# EAGLE design mega_connector_shield (EAGLE 7.3.0)
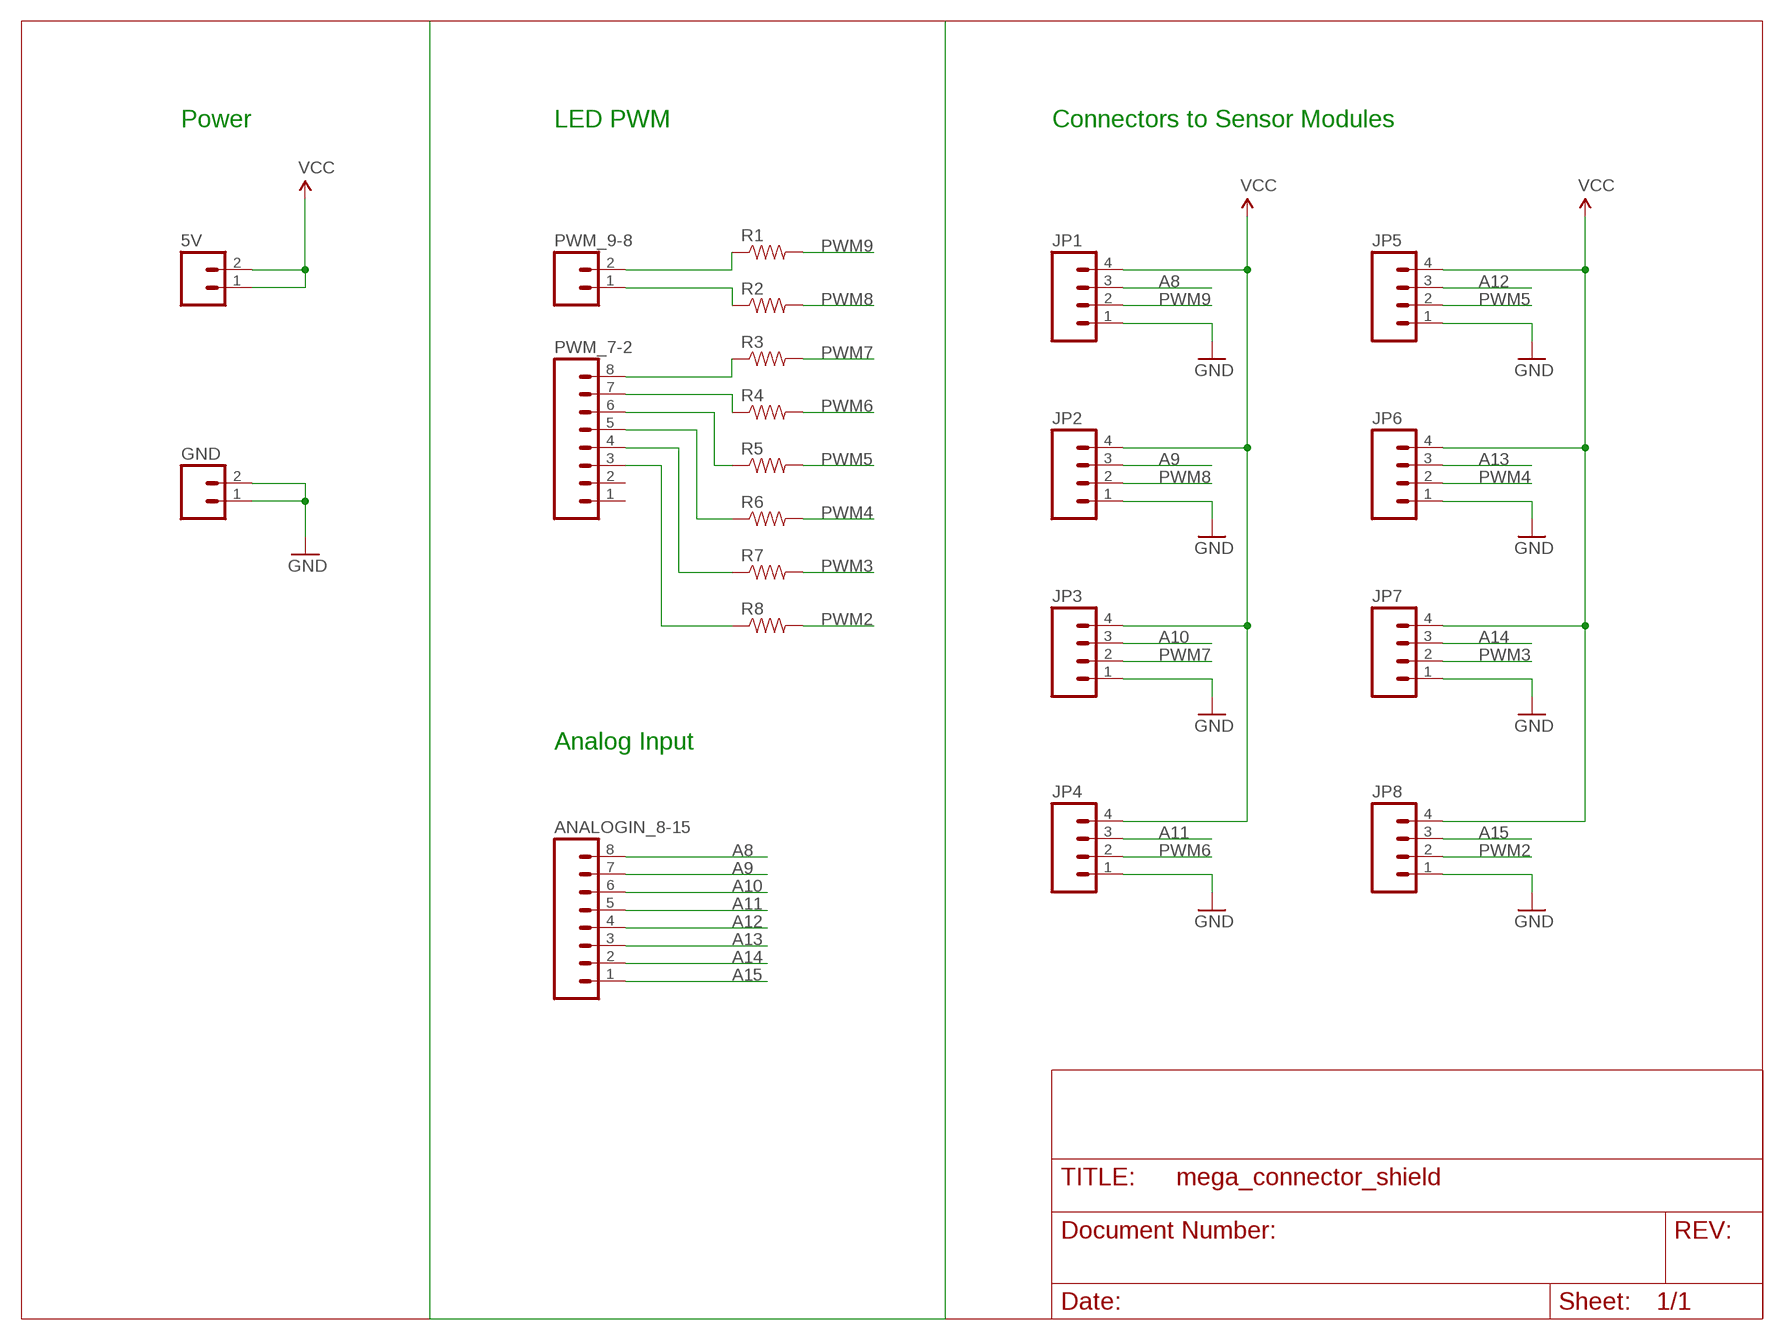
[diagram p0: schematic, sheet 1]

## Parts
5V  M02PTH  [1X02]
ANALOGIN_8-15  M08  [1X08_ROUND]
GND  M02PTH  [1X02]
JP1  M04POLAR  [MOLEX-1X4]
JP2  M04POLAR  [MOLEX-1X4]
JP3  M04POLAR  [MOLEX-1X4]
JP4  M04POLAR  [MOLEX-1X4]
JP5  M04POLAR  [MOLEX-1X4]
JP6  M04POLAR  [MOLEX-1X4]
JP7  M04POLAR  [MOLEX-1X4]
JP8  M04POLAR  [MOLEX-1X4]
PWM_7-2  M08  [1X08_ROUND]
PWM_9-8  M02PTH  [1X02]
R1  RESISTOR1206  [1206]
R2  RESISTOR1206  [1206]
R3  RESISTOR1206  [1206]
R4  RESISTOR1206  [1206]
R5  RESISTOR1206  [1206]
R6  RESISTOR1206  [1206]
R7  RESISTOR1206  [1206]
R8  RESISTOR1206  [1206]

## Nets
A8: ANALOGIN_8-15.8 JP1.3
A9: ANALOGIN_8-15.7 JP2.3
A10: ANALOGIN_8-15.6 JP3.3
A11: ANALOGIN_8-15.5 JP4.3
A12: ANALOGIN_8-15.4 JP5.3
A13: ANALOGIN_8-15.3 JP6.3
A14: ANALOGIN_8-15.2 JP7.3
A15: ANALOGIN_8-15.1 JP8.3
GND: GND.1 GND.2 JP1.1 JP2.1 JP3.1 JP4.1 JP5.1 JP6.1 JP7.1 JP8.1
N$1: PWM_9-8.2 R1.1
N$2: PWM_9-8.1 R2.1
N$3: PWM_7-2.8 R3.1
N$5: PWM_7-2.7 R4.1
N$7: PWM_7-2.6 R5.1
N$9: PWM_7-2.5 R6.1
N$11: PWM_7-2.4 R7.1
N$12: PWM_7-2.3 R8.1
PWM2: JP8.2 R8.2
PWM3: JP7.2 R7.2
PWM4: JP6.2 R6.2
PWM5: JP5.2 R5.2
PWM6: JP4.2 R4.2
PWM7: JP3.2 R3.2
PWM8: JP2.2 R2.2
PWM9: JP1.2 R1.2
VCC: 5V.1 5V.2 JP1.4 JP2.4 JP3.4 JP4.4 JP5.4 JP6.4 JP7.4 JP8.4
Unconnected: PWM_7-2.1 PWM_7-2.2

## Notes on the sheet
- Power | LED PWM | Connectors to Sensor Modules
- Analog Input

## Library data of the parts
5V GND PWM_9-8 = SparkFun-Connectors:M02: Standard 2-pin 0.1" header. Use with - straight break away headers ( PRT-00116) - right angle break away headers (PRT-00553) - swiss pins (PRT-00743) - machine pins (PRT-00117) - female headers (PRT-00115) Molex polarized connector foot print use with: PRT-08233 with associated crimp pins and housings. 2.54_SCREWTERM for use with PRT-10571. 3.5mm Screw Terminal footprints for PRT-08084 5mm Screw Terminal footprints for use with PRT-08432
ANALOGIN_8-15 PWM_7-2 = SparkFun-Connectors:M08: Header 8 Standard 8-pin 0.1" header. Use with straight break away headers (SKU : PRT-00116), right angle break away headers (PRT-00553), swiss pins (PRT-00743), machine pins (PRT-00117), and female headers (PRT-00115).
JP1-JP8 = SparkFun-Connectors:M04: Header 4 Standard 4-pin 0.1" header. Use with straight break away headers (SKU : PRT-00116), right angle break away headers (PRT-00553), swiss pins (PRT-00743), machine pins (PRT-00117), and female headers (PRT-00115). Molex polarized connector foot print use with SKU : PRT-08231 with associated crimp pins and housings. 1MM SMD Version SKU: PRT-10208
R1-R8 = SparkFun-Passives:RESISTOR: Resistor Basic schematic elements and footprints for 0603, 1206, and PTH resistors.

## Board
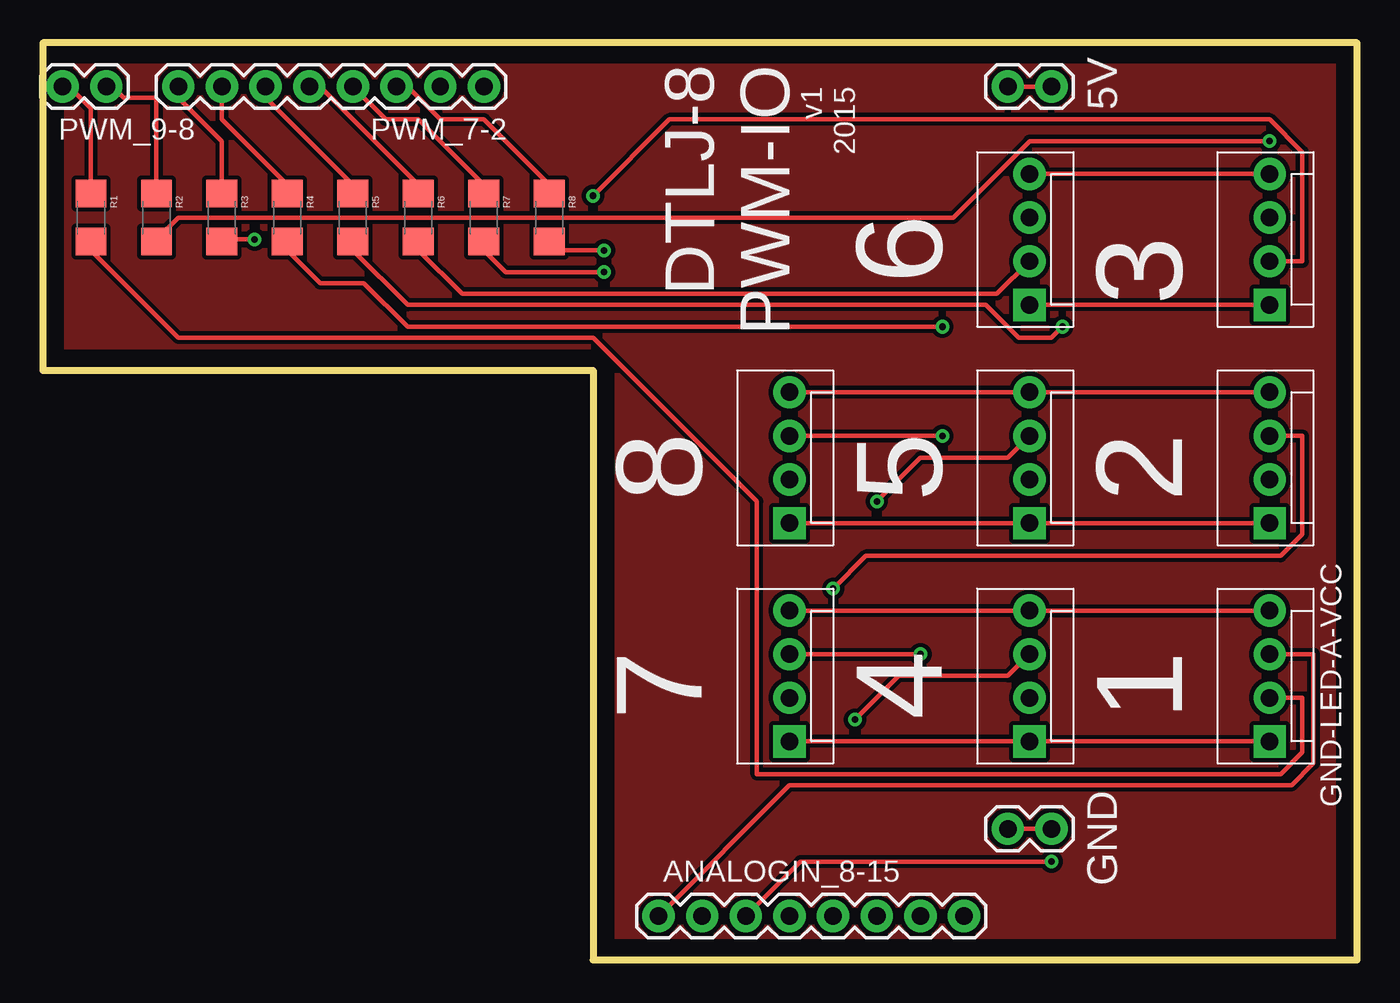
[diagram p1: board, top side]
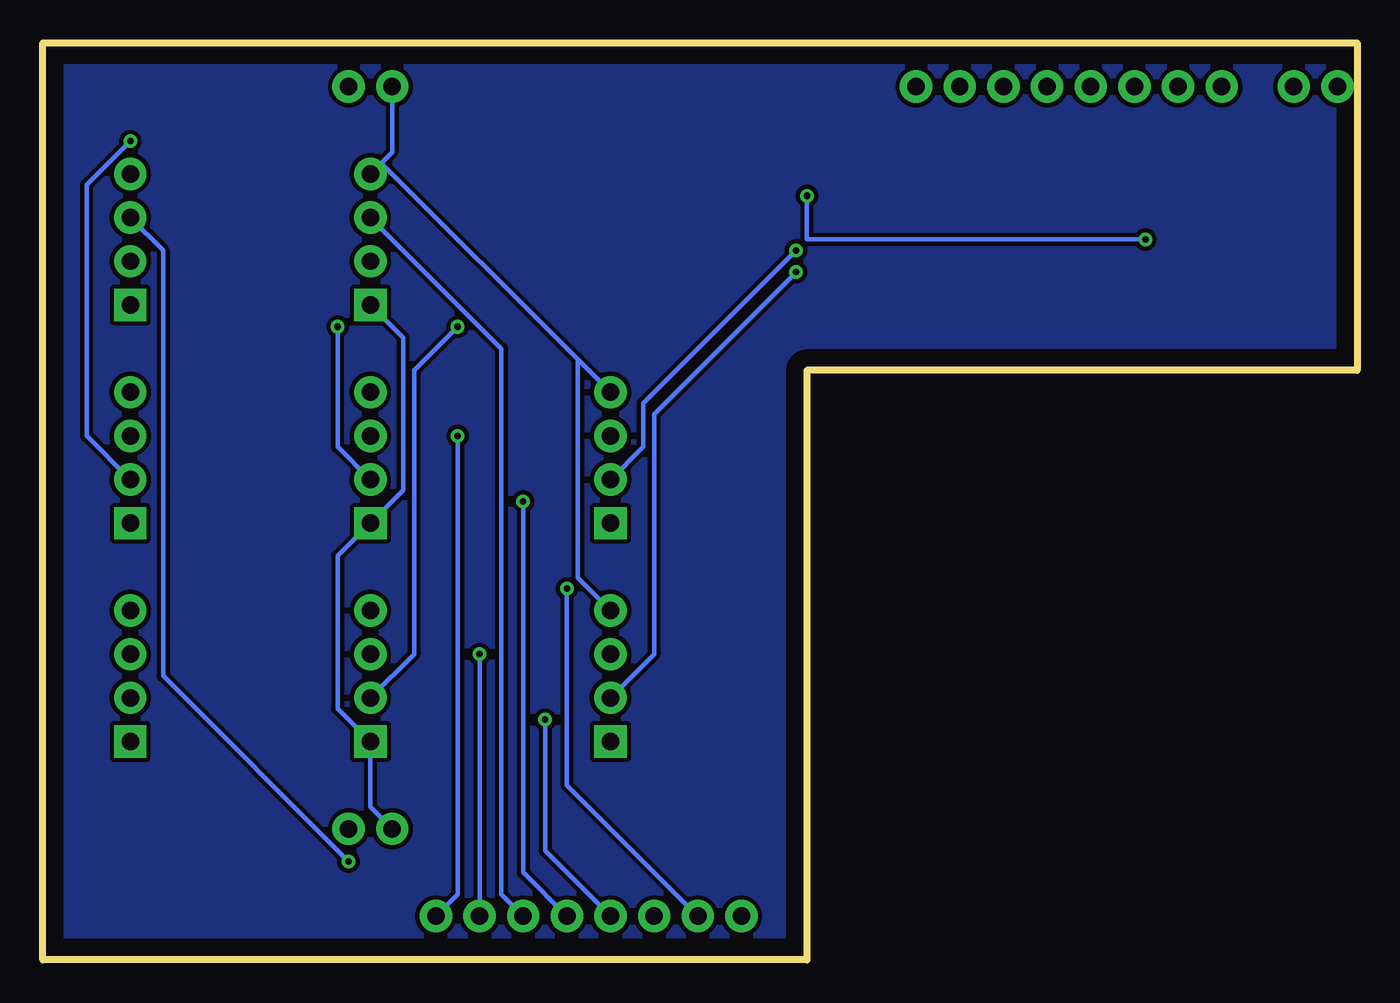
[diagram p2: board, bottom side, seen from below]

Size 76.45 x 53.34 mm. Coordinates in mm from the lower left corner, seen from the top.
Outline: 0,53.34 0,34.29 32,34.29 32,0 76.45,0 76.45,53.34 0,53.34
Copper layers (1*16): Top 0.035mm / dielectric 1.5mm / Bottom 0.035mm
Design rules "goldphoenix": minimum track width 10mil, minimum drill 15mil, track to track 10mil, track to pad 10mil, pad to pad 10mil, via to via 10mil, smd to smd 10mil, copper to edge 40mil, drill to drill 10mil, minimum pad ring 10mil, minimum via ring 8mil, stop-mask expansion 4mil, vias tented up to drill 0mil, thermal gap 10mil

### Footprints (pad centres in the part's own frame; a part is rotated, then mirrored left to right if it is on the bottom)
1X02 = drill 1.016 pad 1.88: 1 0,0; 2 2.54,0
1X08_ROUND = drill 1.016 pad 1.88: 1 0,0; 2 2.54,0; 3 5.08,0; 4 7.62,0; 5 10.16,0; 6 12.7,0; 7 15.24,0; 8 17.78,0
MOLEX-1X4 = drill 1.016 pad 1.88 square: 1 0,0 | drill 1.016 pad 1.88: 2 2.54,0; 3 5.08,0; 4 7.62,0
1206 = smd 1.6 x 1.8: 1 -1.4,0; 2 1.4,0

### Placement (x,y rotation side)
5V  56.13,50.8 0 top
ANALOGIN_8-15  53.59,2.54 180 top
GND  56.13,7.62 0 top
JP1  71.37,12.7 90 top
JP2  71.37,25.4 90 top
JP3  71.37,38.1 90 top
JP4  57.4,12.7 90 top
JP5  57.4,25.4 90 top
JP6  57.4,38.1 90 top
JP7  43.43,12.7 90 top
JP8  43.43,25.4 90 top
PWM_7-2  25.65,50.8 180 top
PWM_9-8  3.68,50.8 180 top
R1  2.79,43.18 270 top
R2  6.6,43.18 270 top
R3  10.41,43.18 270 top
R4  14.22,43.18 270 top
R5  18.03,43.18 270 top
R6  21.84,43.18 270 top
R7  25.65,43.18 270 top
R8  29.46,43.18 270 top

### Tracks (layer width: path | path; a pad name or v marks a point on that pad's centre or on a via)
A8
  Top 0.254: ANALOGIN_8-15.8 43.43,10.16 72.64,10.16 73.91,11.43 73.91,17.78 JP1.3
A9  (via drill 0.38)
  Top 0.254: v45.97,21.59 47.88,23.5 72.01,23.5 73.28,24.77 73.28,30.48 JP2.3
  Bottom 0.254: ANALOGIN_8-15.7 45.97,10.16 v45.97,21.59
A10  (via drill 0.38)
  Top 0.254: ANALOGIN_8-15.6 44.07,5.71 v58.67,5.71
  Bottom 0.254: v58.67,5.71 69.47,16.51 69.47,41.27 JP3.3
A11  (via drill 0.38)
  Top 0.254: v47.24,13.97 49.78,16.51 56.13,16.51 JP4.3
  Bottom 0.254: ANALOGIN_8-15.5 47.24,6.35 v47.24,13.97
A12  (via drill 0.38)
  Top 0.254: v48.51,26.67 51.05,29.21 56.13,29.21 JP5.3
  Bottom 0.254: ANALOGIN_8-15.4 48.51,5.08 v48.51,26.67
A13
  Bottom 0.254: ANALOGIN_8-15.3 49.78,3.81 49.78,35.56 JP6.3
A14  (via drill 0.38)
  Top 0.254: JP7.3 v51.05,17.78
  Bottom 0.254: v51.05,17.78 ANALOGIN_8-15.2
A15  (via drill 0.38)
  Top 0.254: JP8.3 v52.32,30.48
  Bottom 0.254: ANALOGIN_8-15.1 52.32,3.81 v52.32,30.48
GND
  Top 0.254: GND.2 GND.1 | JP7.1 JP4.1 JP1.1 | JP3.1 JP6.1 | JP8.1 JP5.1 JP2.1
  Bottom 0.254: GND.1 57.4,8.89 JP4.1 59.31,14.61 59.31,23.5 JP5.1 55.5,27.3 55.5,36.2 JP6.1
N$1
  Top 0.254: R1.1 2.79,49.53 1.52,50.8 PWM_9-8.2
N$2
  Top 0.254: R2.1 6.6,50.16 4.7,50.16 4.06,50.8 PWM_9-8.1
N$3
  Top 0.254: R3.1 10.41,47.62 7.87,50.16 PWM_7-2.8
N$4
  pour Bottom: 0.25,53.34 76.45,53.34 76.45,0 32,0 32,34.29 0.25,34.29
N$5
  Top 0.254: PWM_7-2.7 10.41,48.9 14.22,45.09 R4.1
N$6
  pour Top: 0.25,53.34 76.45,53.34 76.45,0 32,0 32,34.29 0.25,34.29
N$7
  Top 0.254: PWM_7-2.6 12.95,50.16 18.03,45.09 R5.1
N$9
  Top 0.254: PWM_7-2.5 16.13,50.8 21.84,45.09 R6.1
N$11
  Top 0.254: PWM_7-2.4 19.94,48.9 21.84,48.9 25.65,45.09 R7.1
N$12
  Top 0.254: PWM_7-2.3 21.21,50.8 23.11,48.9 25.65,48.9 29.46,45.09 R8.1
PWM2  (via drill 0.38)
  Top 0.254: v32.64,41.27 29.46,41.27 R8.2
  Bottom 0.254: v32.64,41.27 41.53,32.38 41.53,29.84 JP8.2
PWM3  (via drill 0.38)
  Top 0.254: v32.64,40.01 26.92,40.01 25.65,41.27 R7.2
  Bottom 0.254: v32.64,40.01 40.89,31.75 40.89,17.78 JP7.2
PWM4
  Top 0.254: JP6.2 55.5,38.73 24.38,38.73 21.84,41.27 R6.2
PWM5  (via drill 0.38)
  Top 0.254: v59.31,36.83 58.67,36.2 56.77,36.2 54.86,38.1 21.21,38.1 18.03,41.27 R5.2
  Bottom 0.254: v59.31,36.83 59.31,29.84 JP5.2
PWM6  (via drill 0.38)
  Top 0.254: v52.32,36.83 21.21,36.83 18.67,39.37 16.13,39.37 14.22,41.27 R4.2
  Bottom 0.254: v52.32,36.83 54.86,34.29 54.86,17.78 JP4.2
PWM7  (via drill 0.38)
  Top 0.254: v12.32,41.91 10.41,41.91 R3.2 | v32,44.45 36.45,48.9 71.37,48.9 73.28,46.99 73.28,40.64 JP3.2
  Bottom 0.254: v12.32,41.91 32,41.91 v32,44.45
PWM8  (via drill 0.38)
  Top 0.254: v71.37,47.62 57.4,47.62 52.96,43.18 7.87,43.18 6.6,41.91 R2.2
  Bottom 0.254: v71.37,47.62 73.91,45.09 73.91,30.48 JP2.2
PWM9
  Top 0.254: JP1.2 73.28,15.24 73.28,12.06 72.01,10.79 41.53,10.79 41.53,26.67 32,36.2 7.87,36.2 2.79,41.27 R1.2
VCC
  Top 0.254: JP7.4 JP4.4 JP1.4 | 5V.2 5V.1 | JP6.4 JP3.4 | JP8.4 JP5.4 JP2.4
  Bottom 0.254: 56.77,46.35 56.13,46.99 5V.1 | JP8.4 45.34,34.92 | 45.34,34.92 56.77,46.35 | 56.77,46.35 JP6.4 | JP7.4 45.34,22.23 45.34,34.92

### Text on the board
tNames: DTLJ-8 / PWM-IO | v1 / 2015 | 6 | 3 | 8 | 5 | 2 | 7 | 4 | 1 | GND-LED-A-VCC